# Altium project Lens-Maker.PrjPcb
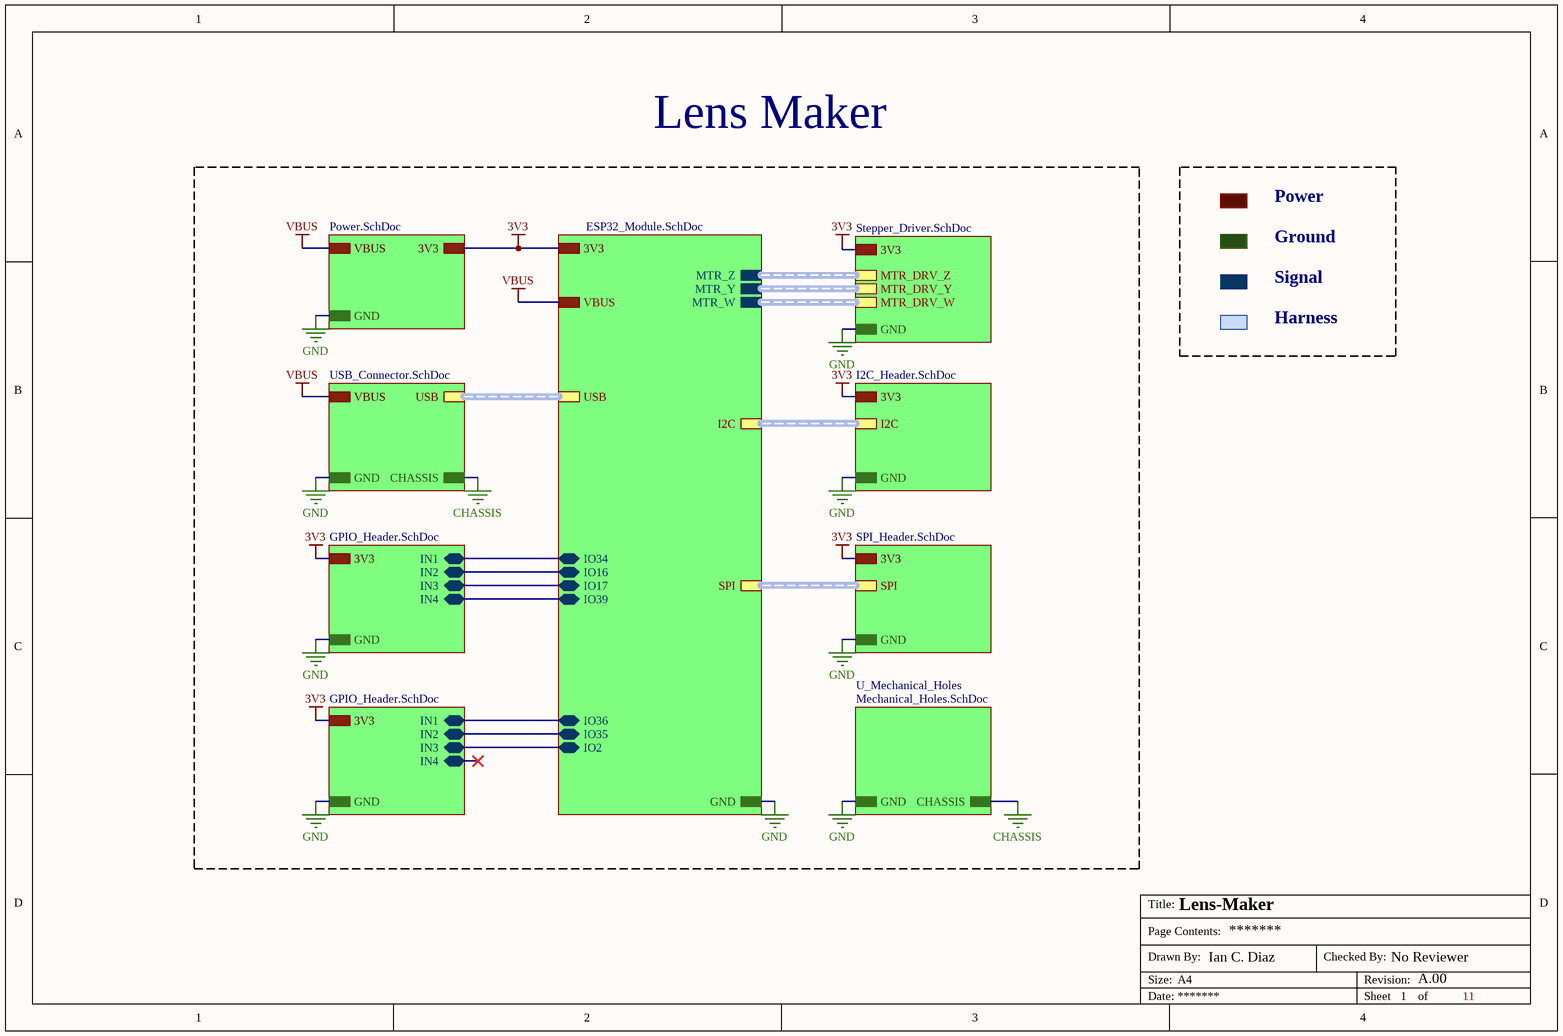
[diagram p0: Lens-Maker.SchDoc]
pcb_author: Ian C. Diaz; pcb_name: Lens-Maker; pcb_rev: A.00; pcb_reviewer: No Reviewer; TotalSheet: 11
11 sheets, 125 parts. Net scope: hierarchical (ports join the sheet entries above them; power ports are global).
Board file: Lens-Maker.PcbDoc
Sheets:
  Lens-Maker.SchDoc
    U_ESP32_Module = ESP32_Module.SchDoc
      U_ESP32_Block = ESP32_Block.SchDoc
    U_GPIO_Header = GPIO_Header.SchDoc
    U_I2C_Header = I2C_Header.SchDoc
    U_SPI_Header = SPI_Header.SchDoc
    U_Stepper_Driver = Stepper_Driver.SchDoc
      U_A4988 = A4988.SchDoc
      U_A4988 = A4988.SchDoc
      U_A4988 = A4988.SchDoc
    U_GPIO_Header = GPIO_Header.SchDoc
    U_USB_Connector = USB_Connector.SchDoc
    U_Power = Power.SchDoc
    U_Mechanical_Holes = Mechanical_Holes.SchDoc

## Sheet Lens-Maker.SchDoc: Title
size A4; Date: *******; ApprovedBy: *******; CheckedBy: None; Author: *******; CompanyName: *******; DrawnBy: Name; Engineer: *******; Organization: *******; Address1: *******; Address2: *******; Address3: *******; Address4: *******; DocumentNumber: 1; Revision: *******; SheetNumber: 1; SheetTotal: 11; CurrentTime: *******; CurrentDate: *******; Time: *******; DocumentFullPathAndName: *******; DocumentName: *******; ModifiedDate: *******; ImagePath: *******; ProjectName: *******; Application_BuildNumber: *******

### Sub-sheets
U_ESP32_Module = ESP32_Module.SchDoc: 3V3, GND, MTR_Z (harness MTR_DRV), MTR_W (harness MTR_DRV), MTR_Y (harness MTR_DRV), IO34 (bidir), IO16 (bidir), IO17 (bidir), I2C (harness I2C), SPI (harness SPI), IO39 (bidir), IO36 (bidir), IO35 (bidir), IO2 (bidir), VBUS, USB (harness USB)
U_GPIO_Header = GPIO_Header.SchDoc: 3V3, GND, IN1 (bidir), IN2 (bidir), IN3 (bidir), IN4 (bidir)
U_GPIO_Header = GPIO_Header.SchDoc: 3V3, GND, IN1 (bidir), IN2 (bidir), IN3 (bidir), IN4 (bidir)
U_I2C_Header = I2C_Header.SchDoc: 3V3, GND, I2C (harness I2C)
U_Mechanical_Holes = Mechanical_Holes.SchDoc: GND, CHASSIS
U_Power = Power.SchDoc: 3V3, GND, VBUS
U_SPI_Header = SPI_Header.SchDoc: 3V3, GND, SPI (harness SPI)
U_Stepper_Driver = Stepper_Driver.SchDoc: 3V3, GND, MTR_DRV_Z (harness MTR_DRV), MTR_DRV_Y (harness MTR_DRV), MTR_DRV_W (harness MTR_DRV)
U_USB_Connector = USB_Connector.SchDoc: GND, CHASSIS, VBUS, USB (harness USB)

### Nets
3V3: sheet U_ESP32_Module/3V3, sheet U_GPIO_Header/3V3, sheet U_I2C_Header/3V3, sheet U_SPI_Header/3V3, sheet U_Stepper_Driver/3V3, sheet U_GPIO_Header/3V3, sheet U_Power/3V3
CHASSIS: sheet U_USB_Connector/CHASSIS, sheet U_Mechanical_Holes/CHASSIS
GND: sheet U_ESP32_Module/GND, sheet U_GPIO_Header/GND, sheet U_I2C_Header/GND, sheet U_SPI_Header/GND, sheet U_Stepper_Driver/GND, sheet U_GPIO_Header/GND, sheet U_USB_Connector/GND, sheet U_Power/GND, sheet U_Mechanical_Holes/GND
VBUS: sheet U_ESP32_Module/VBUS, sheet U_USB_Connector/VBUS, sheet U_Power/VBUS
IN1: sheet U_ESP32_Module/IO34, sheet U_GPIO_Header/IN1
IN1: sheet U_ESP32_Module/IO36, sheet U_GPIO_Header/IN1  [a separate net that carries the same name]
IN2: sheet U_ESP32_Module/IO35, sheet U_GPIO_Header/IN2
IN2: sheet U_ESP32_Module/IO16, sheet U_GPIO_Header/IN2  [a separate net that carries the same name]
IN3: sheet U_ESP32_Module/IO2, sheet U_GPIO_Header/IN3
IN3: sheet U_ESP32_Module/IO17, sheet U_GPIO_Header/IN3  [a separate net that carries the same name]
IN4: sheet U_ESP32_Module/IO39, sheet U_GPIO_Header/IN4

### Buses and harness runs
harness sheet U_ESP32_Module/I2C = sheet U_I2C_Header/I2C
harness sheet U_ESP32_Module/MTR_W = sheet U_Stepper_Driver/MTR_DRV_W
harness sheet U_ESP32_Module/MTR_Y = sheet U_Stepper_Driver/MTR_DRV_Y
harness sheet U_ESP32_Module/MTR_Z = sheet U_Stepper_Driver/MTR_DRV_Z
harness sheet U_ESP32_Module/SPI = sheet U_SPI_Header/SPI
harness sheet U_ESP32_Module/USB = sheet U_USB_Connector/USB

### Notes on the sheet
- Lens Maker
- Power
- Ground
- Signal
- Harness
- Title:
- Size:
- Date:
- Drawn By:
- Page Contents:
- A4
- Checked By:
- Revision:
- Sheet
- of

## Sheet ESP32_Module.SchDoc: Title
size A4; Date: *******; ApprovedBy: *******; CheckedBy: None; Author: *******; CompanyName: *******; DrawnBy: Name; Engineer: *******; Organization: *******; Address1: *******; Address2: *******; Address3: *******; Address4: *******; DocumentNumber: 5; Revision: *******; SheetNumber: 5; SheetTotal: 11; CurrentTime: *******; CurrentDate: *******; Time: *******; DocumentFullPathAndName: *******; DocumentName: *******; ModifiedDate: *******; ImagePath: *******; ProjectName: *******; Application_BuildNumber: *******
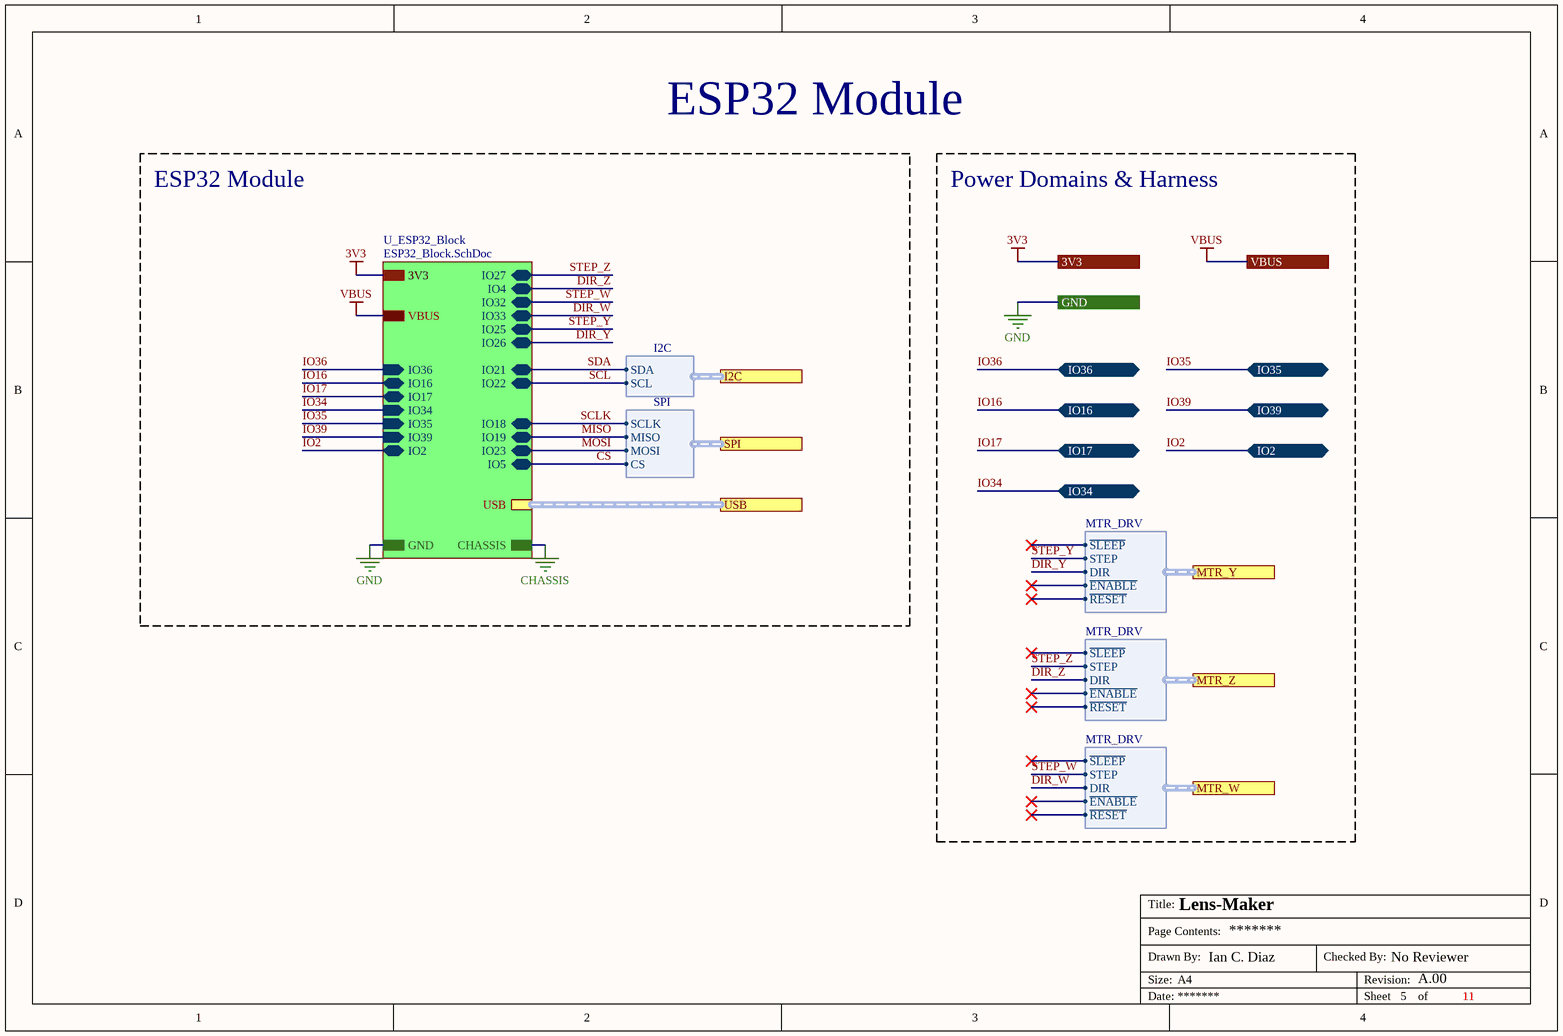
[diagram p1: ESP32_Module.SchDoc]

### Sub-sheets
U_ESP32_Block = ESP32_Block.SchDoc: IO34 (in), IO35 (in), IO32 (bidir), IO33 (bidir), IO25 (bidir), IO26 (bidir), IO27 (bidir), IO2 (bidir), IO4 (bidir), IO16 (bidir), IO17 (bidir), IO5 (bidir), IO18 (bidir), IO19 (bidir), IO21 (bidir), IO22 (bidir), IO23 (bidir), IO36 (in), IO39 (in), 3V3, GND, CHASSIS, VBUS, USB (harness USB)

### Ports
3V3 (see Lens-Maker[2A], A4988[3B], ESP32_Block[3C], GPIO_Header[3B], I2C_Header[3B], Power[3B], SPI_Header[3B], Stepper_Driver[3A]), GND (see Lens-Maker[2D], A4988[3B], ESP32_Block[3D], GPIO_Header[3B], I2C_Header[3B], Mechanical_Holes[3B], Power[3C], SPI_Header[3B], Stepper_Driver[3B], USB_Connector[3B]), I2C (harness I2C, see Lens-Maker[2B], I2C_Header[3C]), IO2 (bidir, see Lens-Maker[2C], ESP32_Block[4C]), IO16 (bidir, see Lens-Maker[2C], ESP32_Block[4C]), IO17 (bidir, see Lens-Maker[2C], ESP32_Block[4C]), IO34 (bidir, see Lens-Maker[2C], ESP32_Block[3C]), IO35 (bidir, see Lens-Maker[2C], ESP32_Block[3C]), IO36 (bidir, see Lens-Maker[2C], ESP32_Block[4C]), IO39 (bidir, see Lens-Maker[2C], ESP32_Block[4D]), MTR_W (harness MTR_DRV, see Lens-Maker[2B]), MTR_Y (harness MTR_DRV, see Lens-Maker[2B]), MTR_Z (harness MTR_DRV, see Lens-Maker[2B]), SPI (harness SPI, see Lens-Maker[2C], SPI_Header[3C]), USB (harness USB, see Lens-Maker[2B], ESP32_Block[3C], USB_Connector[3C]), VBUS (see Lens-Maker[2B], ESP32_Block[3C], Power[3B], USB_Connector[3B])

### Harnesses
I2C: SDA, SCL
SPI: SCLK, MISO, MOSI, CS
MTR_DRV: ~{SLEEP}, STEP, DIR, ~{ENABLE}, ~{RESET}

### Nets
3V3: port 3V3, sheet U_ESP32_Block/3V3
GND: port GND, sheet U_ESP32_Block/GND
VBUS: port VBUS, sheet U_ESP32_Block/VBUS
CS: sheet U_ESP32_Block/IO5, port SPI.CS
DIR_W: sheet U_ESP32_Block/IO33, port MTR_W.DIR  [project net DIR]
DIR_Y: sheet U_ESP32_Block/IO26, port MTR_Y.DIR  [project net DIR]
DIR_Z: sheet U_ESP32_Block/IO4, port MTR_Z.DIR  [project net DIR]
IO2: port IO2, sheet U_ESP32_Block/IO2  [project net IN3]
IO16: port IO16, sheet U_ESP32_Block/IO16  [project net IN2]
IO17: port IO17, sheet U_ESP32_Block/IO17  [project net IN3]
IO34: port IO34, sheet U_ESP32_Block/IO34  [project net IN1]
IO35: port IO35, sheet U_ESP32_Block/IO35  [project net IN2]
IO36: port IO36, sheet U_ESP32_Block/IO36  [project net IN1]
IO39: port IO39, sheet U_ESP32_Block/IO39  [project net IN4]
MISO: sheet U_ESP32_Block/IO19, port SPI.MISO  [project net IO19]
MOSI: sheet U_ESP32_Block/IO23, port SPI.MOSI  [project net IO23]
~{RST}_U_A4988: port MTR_Z.~{SLEEP}, port MTR_Z.~{RESET}
~{RST}_U_A4988: port MTR_Y.~{SLEEP}, port MTR_Y.~{RESET}  [a separate net that carries the same name]
~{RST}_U_A4988: port MTR_W.~{SLEEP}, port MTR_W.~{RESET}  [a separate net that carries the same name]
SCL: sheet U_ESP32_Block/IO22, port I2C.SCL  [project net IO22]
SCLK: sheet U_ESP32_Block/IO18, port SPI.SCLK  [project net IO18]
SDA: sheet U_ESP32_Block/IO21, port I2C.SDA  [project net IO21]
STEP_W: sheet U_ESP32_Block/IO32, port MTR_W.STEP  [project net IO32]
STEP_Y: sheet U_ESP32_Block/IO25, port MTR_Y.STEP  [project net IO25]
STEP_Z: sheet U_ESP32_Block/IO27, port MTR_Z.STEP  [project net IO27]

### Buses and harness runs
harness port USB = sheet U_ESP32_Block/USB

### Notes on the sheet
- ESP32 Module
- Power Domains & Harness
- Title:
- Size:
- Date:
- Drawn By:
- Page Contents:
- A4
- Checked By:
- Revision:
- Sheet
- of

## Sheet ESP32_Block.SchDoc: Title
size A4; Date: *******; ApprovedBy: *******; CheckedBy: None; Author: *******; CompanyName: *******; DrawnBy: Name; Engineer: *******; Organization: *******; Address1: *******; Address2: *******; Address3: *******; Address4: *******; DocumentNumber: 6; Revision: *******; SheetNumber: 6; SheetTotal: 11; CurrentTime: *******; CurrentDate: *******; Time: *******; DocumentFullPathAndName: *******; DocumentName: *******; ModifiedDate: *******; ImagePath: *******; ProjectName: *******; Application_BuildNumber: *******
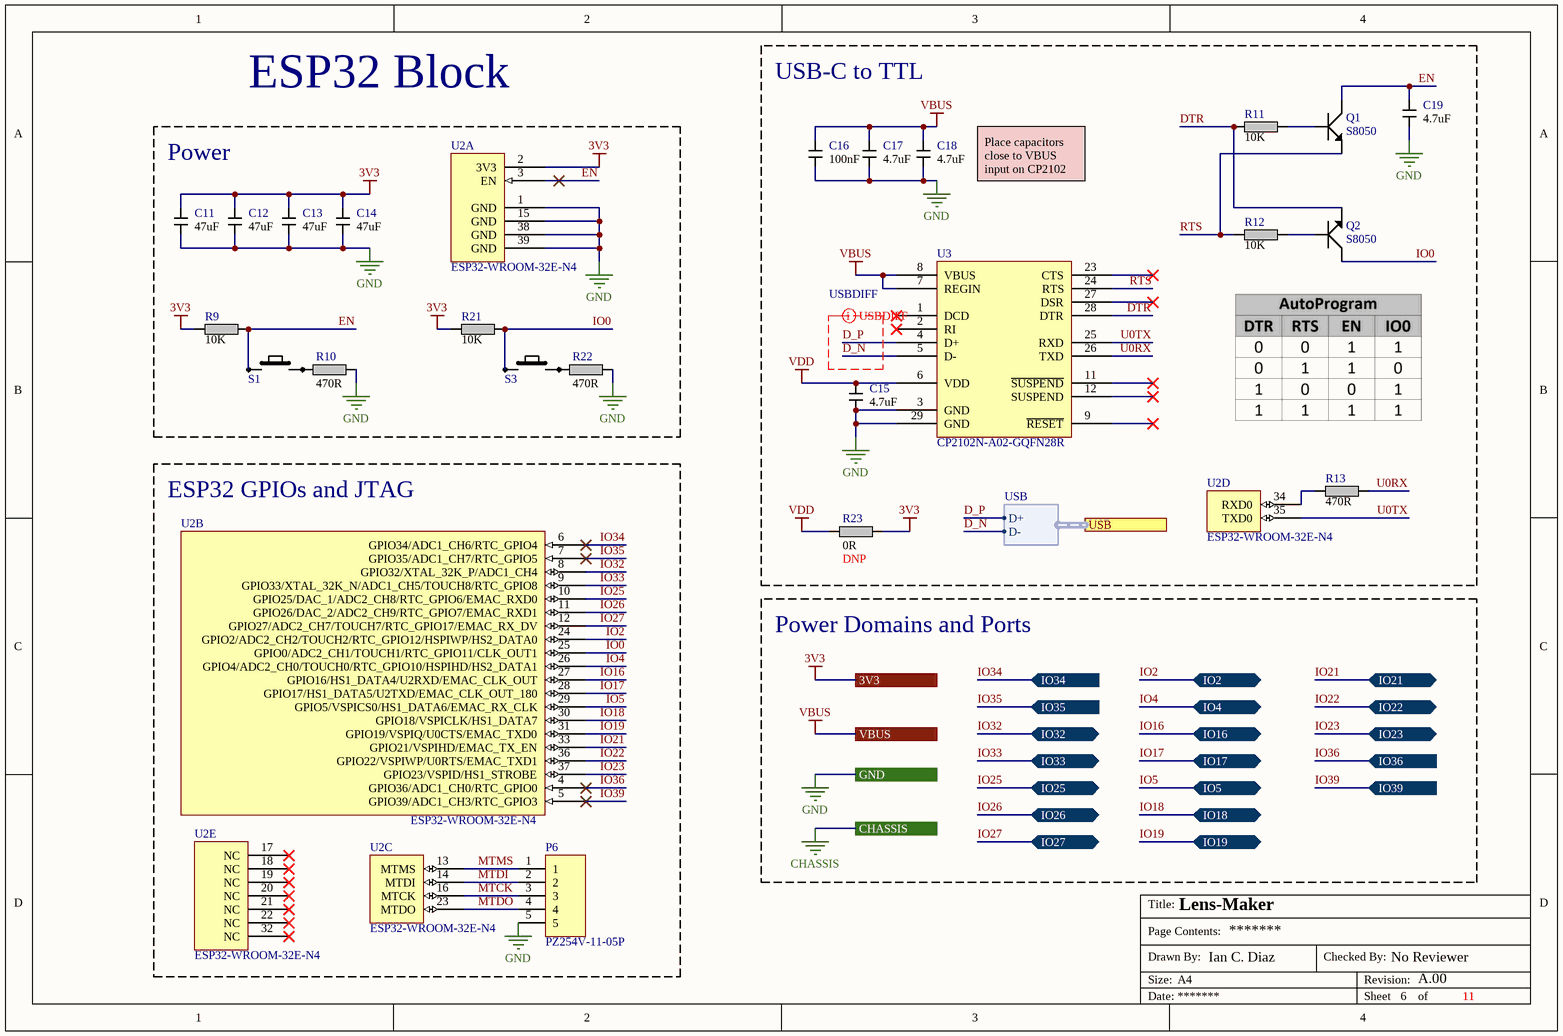
[diagram p2: ESP32_Block.SchDoc]

### Parts
C11  value 47uF  [1206]  (hidden comment: CAP)
C12  value 47uF  [1206]  (hidden comment: CAP)
C13  value 47uF  [1206]  (hidden comment: CAP)
C14  value 47uF  [1206]  (hidden comment: CAP)
C15  value 4.7uF  [0805]  (hidden comment: CAP)
C16  value 100nF  [0805]  (hidden comment: CAP)
C17  value 4.7uF  [0805]  (hidden comment: CAP)
C18  value 4.7uF  [0805]  (hidden comment: CAP)
C19  value 4.7uF  [0805]  (hidden comment: CAP)
P6  HEADER-5P-SR  [PZ254V-11-05P]  (value not drawn)
Q1  S8050  [SOT-23-3]
Q2  S8050  [SOT-23-3]
R9  value 10K  [0805]  (hidden comment: RES)
R10  value 470R  [0805]  (hidden comment: RES)
R11  value 10K  [0805]  (hidden comment: RES)
R12  value 10K  [0805]  (hidden comment: RES)
R13  value 470R  [0805]  (hidden comment: RES)
R21  value 10K  [0805]  (hidden comment: RES)
R22  value 470R  [0805]  (hidden comment: RES)
R23  value 0R  DM: DNP  [0805]  (hidden comment: RES)
S1  RST  [PUSHBUTTON_2]  (value not drawn)
S3  BOOT  [PUSHBUTTON_2]  (value not drawn)
U2  Manufacturer Part Number: ESP32-WROOM-32E-N4  [ESP32-WROOM-32E]  (hidden comment: ESP32-WROOM-32E)  (parts A,B,C,D,E of 5)
U3  Manufacturer Part Number: CP2102N-A02-GQFN28R  [CP2102N]  (hidden comment: CP2102)

### Blocks framed on the sheet
USB-C to TTL: C15-C19 Q1 Q2 R11-R13 R23 U2 U3
Power: C11-C14 R9 R10 R21 R22 S1 S3 U2
ESP32 GPIOs and JTAG: P6 U2

### Ports
3V3 (see ESP32_Module[1B], A4988[3B], ESP32_Module[3B], GPIO_Header[3B], I2C_Header[3B], Power[3B], SPI_Header[3B], Stepper_Driver[3A]), CHASSIS (see ESP32_Module[2C], Mechanical_Holes[3C], USB_Connector[3C]), GND (see ESP32_Module[1C], A4988[3B], ESP32_Module[3B], GPIO_Header[3B], I2C_Header[3B], Mechanical_Holes[3B], Power[3C], SPI_Header[3B], Stepper_Driver[3B], USB_Connector[3B]), IO2 (bidir, see ESP32_Module[1B], ESP32_Module[4B]), IO4 (bidir, see ESP32_Module[2B]), IO5 (bidir, see ESP32_Module[2B]), IO16 (bidir, see ESP32_Module[1B], ESP32_Module[3B]), IO17 (bidir, see ESP32_Module[1B], ESP32_Module[3B]), IO18 (bidir, see ESP32_Module[2B]), IO19 (bidir, see ESP32_Module[2B]), IO21 (bidir, see ESP32_Module[2B]), IO22 (bidir, see ESP32_Module[2B]), IO23 (bidir, see ESP32_Module[2B]), IO25 (bidir, see ESP32_Module[2B]), IO26 (bidir, see ESP32_Module[2B]), IO27 (bidir, see ESP32_Module[2B]), IO32 (bidir, see ESP32_Module[2B]), IO33 (bidir, see ESP32_Module[2B]), IO34 (in, see ESP32_Module[1B], ESP32_Module[3B]), IO35 (in, see ESP32_Module[1B], ESP32_Module[4B]), IO36 (in, see ESP32_Module[1B], ESP32_Module[3B]), IO39 (in, see ESP32_Module[1B], ESP32_Module[4B]), USB (harness USB, see ESP32_Module[2B], USB_Connector[3C]), VBUS (see ESP32_Module[1B], ESP32_Module[4B], Power[3B], USB_Connector[3B])

### Harnesses
USB: D+, D-

### Nets
3V3: C11.1 C12.1 C13.1 C14.1 R9.2 R21.2 R23.1 U2.2(3V3) ; port 3V3
GND: C11.2 C12.2 C13.2 C14.2 C15.2 C16.1 C17.2 C18.2 C19.2 P6.5 R10.1 R22.1 U2.1(GND) U2.15(GND) U2.38(GND) U2.39(GND) U3.3(GND) U3.29(GND) ; port GND
VBUS: C16.2 C17.1 C18.1 U3.7(REGIN) U3.8(VBUS) ; port VBUS
VDD: C15.1 R23.2 U3.6(VDD)
D_N: U3.5(D-) ; port USB.D-
D_P: U3.4(D+) ; port USB.D+
DTR: Q2.2 R11.2 U3.28(DTR)
EN: C19.1 Q1.3 R9.1 S1.1 U2.3(EN)
IO0: Q2.3 R21.1 S3.1 U2.25(GPIO0/ADC2_CH1/TOUCH1/RTC_GPIO11/CLK_OUT1)
IO2: U2.24(GPIO2/ADC2_CH2/TOUCH2/RTC_GPIO12/HSPIWP/HS2_DATA0) ; port IO2  [project net IN3]
IO4: U2.26(GPIO4/ADC2_CH0/TOUCH0/RTC_GPIO10/HSPIHD/HS2_DATA1) ; port IO4  [project net DIR]
IO5: U2.29(GPIO5/VSPICS0/HS1_DATA6/EMAC_RX_CLK) ; port IO5  [project net CS]
IO16: U2.27(GPIO16/HS1_DATA4/U2RXD/EMAC_CLK_OUT) ; port IO16  [project net IN2]
IO17: U2.28(GPIO17/HS1_DATA5/U2TXD/EMAC_CLK_OUT_180) ; port IO17  [project net IN3]
IO18: U2.30(GPIO18/VSPICLK/HS1_DATA7) ; port IO18
IO19: U2.31(GPIO19/VSPIQ/U0CTS/EMAC_TXD0) ; port IO19
IO21: U2.33(GPIO21/VSPIHD/EMAC_TX_EN) ; port IO21
IO22: U2.36(GPIO22/VSPIWP/U0RTS/EMAC_TXD1) ; port IO22
IO23: U2.37(GPIO23/VSPID/HS1_STROBE) ; port IO23
IO25: U2.10(GPIO25/DAC_1/ADC2_CH8/RTC_GPIO6/EMAC_RXD0) ; port IO25
IO26: U2.11(GPIO26/DAC_2/ADC2_CH9/RTC_GPIO7/EMAC_RXD1) ; port IO26  [project net DIR]
IO27: U2.12(GPIO27/ADC2_CH7/TOUCH7/RTC_GPIO17/EMAC_RX_DV) ; port IO27
IO32: U2.8(GPIO32/XTAL_32K_P/ADC1_CH4) ; port IO32
IO33: U2.9(GPIO33/XTAL_32K_N/ADC1_CH5/TOUCH8/RTC_GPIO8) ; port IO33  [project net DIR]
IO34: U2.6(GPIO34/ADC1_CH6/RTC_GPIO4) ; port IO34  [project net IN1]
IO35: U2.7(GPIO35/ADC1_CH7/RTC_GPIO5) ; port IO35  [project net IN2]
IO36: U2.4(GPIO36/ADC1_CH0/RTC_GPIO0) ; port IO36  [project net IN1]
IO39: U2.5(GPIO39/ADC1_CH3/RTC_GPIO3) ; port IO39  [project net IN4]
MTCK: P6.3 U2.16(MTCK)
MTDI: P6.2 U2.14(MTDI)
MTDO: P6.4 U2.23(MTDO)
MTMS: P6.1 U2.13(MTMS)
RTS: Q1.2 R12.2 U3.24(RTS)
U0RX: R13.2 U3.26(TXD)
U0TX: U2.35(TXD0) U3.25(RXD)
NetQ1_1: Q1.1 R11.1
NetQ2_1: Q2.1 R12.1
NetR10_2: R10.2 S1.2
NetR13_1: R13.1 U2.34(RXD0)
NetR22_2: R22.2 S3.2

Not connected (* = marked no-connect by the designer): U2 17(NC)* 18(NC)* 19(NC)* 20(NC)* 21(NC)* 22(NC)* 32(NC)*; U3 1(DCD)* 2(RI)* 9(~{RESET})* 11(~{SUSPEND})* 12(SUSPEND)* 23(CTS)* 27(DSR)*

### Layout directives
differential pair; differential pair class USBDIFF: D_N, D_P

### Notes on the sheet
- ESP32 Block
- Place capacitors close to VBUS input on CP2102
- Power Domains and Ports
- Title:
- Size:
- Date:
- Drawn By:
- Page Contents:
- A4
- Checked By:
- Revision:
- Sheet
- of

### Library data of the parts
C11-C14 = CAP: 25V 47uF X5R ±20% 1206  Multilayer Ceramic Capacitors MLCC - SMD/SMT ROHS; Manufacturer: TDK; Manufacturer Part Number: C3216X5R1E476MTJ00E; Supplier: JLCPCB; Supplier Part Number: C76659
C15 C17-C19 = CAP: 35V 4.7uF X7R ±10% 0805  Multilayer Ceramic Capacitors MLCC - SMD/SMT ROHS; Manufacturer: Samwha Capacitor; Manufacturer Part Number: CS2012X7R475K350NRE; Supplier: JLCPCB; Supplier Part Number: C560882
C16 = CAP: 50V 100nF X7R ±10% 0805  Multilayer Ceramic Capacitors MLCC - SMD/SMT ROHS; Manufacturer: YAGEO; Manufacturer Part Number: CC0805KRX7R9BB104; Supplier: JLCPCB; Supplier Part Number: C49678
P6 = HEADER-5P-SR: Straight Square Pins 2.5mm 6mm -40℃~+105℃ 3mm 5 2.54mm Black Brass 1x5P Plugin,P=2.54mm  Pin Headers ROHS; Manufacturer: XFCN; Supplier: JLCPCB; Supplier Part Number: C492404; Manufacturer Part Number: PZ254V-11-05P
Q1 Q2 = S8050: 25V 300mW 500mA SOT-23  Bipolar Transistors - BJT ROHS; Manufacturer: JSMSEMI; Supplier: JLCPCB; Supplier Part Number: C916390; Manufacturer Part Number: S8050
R9 R11 R12 R21 = RES: 125mW Thick Film Resistors ±1% 10kΩ 0805  Chip Resistor - Surface Mount ROHS; Manufacturer: UNI-ROYAL(Uniroyal Elec); Manufacturer Part Number: 0805W8F1002T5E; Supplier: JLCPCB; Supplier Part Number: C17414
R10 R13 R22 = RES: 125mW Thick Film Resistors ±1% 470Ω 0805  Chip Resistor - Surface Mount ROHS; Manufacturer: UNI-ROYAL(Uniroyal Elec); Manufacturer Part Number: 0805W8F4700T5E; Supplier: JLCPCB; Supplier Part Number: C17710
R23 = RES: 125mW 0Ω 0805 Chip Resistor - Surface Mount ROHS; Manufacturer: PANASONIC; Manufacturer Part Number: ERJ6GEY0R00V; Supplier: JLCPCB; Supplier Part Number: C169855
S1 S3 = PUSHBUTTON_2: SWITCH TACTILE SPST-NO 0.05A 12V; Manufacturer: C&K; Manufacturer Part Number: PTS645SM43SMTR92LFS; Supplier: JLCPCB; Supplier Part Number: C221880
U2 = ESP32-WROOM-32E: RX TXRX MOD WIFI TRACE ANT SMD; Manufacturer: Espressif Systems; Supplier: JLCPCB; Supplier Part Number: C701341
U3 = CP2102: QFN-28 USB ICs ROHS; Manufacturer: SILICON LABS; Supplier: JLCPCB; Supplier Part Number: C964632

## Sheet GPIO_Header.SchDoc: Title
size A4; Date: *******; ApprovedBy: *******; CheckedBy: None; Author: *******; CompanyName: *******; DrawnBy: Name; Engineer: *******; Organization: *******; Address1: *******; Address2: *******; Address3: *******; Address4: *******; DocumentNumber: 9; Revision: *******; SheetNumber: 9; SheetTotal: 11; CurrentTime: *******; CurrentDate: *******; Time: *******; DocumentFullPathAndName: *******; DocumentName: *******; ModifiedDate: *******; ImagePath: *******; ProjectName: *******; Application_BuildNumber: *******
Used 2 times, as channels U_GPIO_Header, U_GPIO_Header. Parts and nets are listed once, with the designators drawn on the sheet.
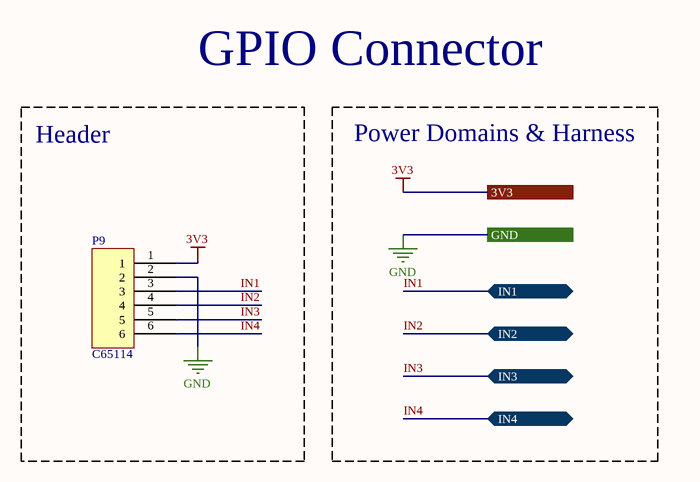
[diagram p3: GPIO_Header.SchDoc]

### Parts
P9  Manufacturer Part Number: C65114  [HEADER 3X2]  (hidden comment: HEADER 6POS)

### Blocks framed on the sheet
Header: P9

### Ports
3V3 (see Lens-Maker[1C], A4988[3B], ESP32_Block[3C], ESP32_Module[3B], I2C_Header[3B], Power[3B], SPI_Header[3B], Stepper_Driver[3A]), GND (see Lens-Maker[1D], A4988[3B], ESP32_Block[3D], ESP32_Module[3B], I2C_Header[3B], Mechanical_Holes[3B], Power[3C], SPI_Header[3B], Stepper_Driver[3B], USB_Connector[3B]), IN1 (bidir, see Lens-Maker[2C]), IN2 (bidir, see Lens-Maker[2C]), IN3 (bidir, see Lens-Maker[2C]), IN4 (bidir, see Lens-Maker[2C])

### Nets
3V3: P9.1 ; port 3V3
GND: P9.2 ; port GND
IN1: P9.3 ; port IN1
IN2: P9.4 ; port IN2
IN3: P9.5 ; port IN3
IN4: P9.6 ; port IN4

### Channels
U_GPIO_Header: designators end in _2; ports 3V3=3V3 GND=GND IN1=IN1 IN2=IN2 IN3=IN3 IN4=IN4
U_GPIO_Header: designators end in _1; ports 3V3=3V3 GND=GND IN1=IN1 IN2=IN2 IN3=IN3 IN4=IN4_U_GPIO_Header

### Notes on the sheet
- GPIO Connector
- Power Domains & Harness
- Title:
- Size:
- Date:
- Drawn By:
- Page Contents:
- A4
- Checked By:
- Revision:
- Sheet
- of

### Library data of the parts
P9 = HEADER 6POS: Straight 2 6 2.54mm Black Straight,P=2.54mm  Pin Headers ROHS; Manufacturer: BOOMELE(Boom Precision Elec); Supplier: JLCPCB; Supplier Part Number: C65114

## Sheet I2C_Header.SchDoc: Title
size A4; Date: *******; ApprovedBy: *******; CheckedBy: None; Author: *******; CompanyName: *******; DrawnBy: Name; Engineer: *******; Organization: *******; Address1: *******; Address2: *******; Address3: *******; Address4: *******; DocumentNumber: 8; Revision: *******; SheetNumber: 8; SheetTotal: 11; CurrentTime: *******; CurrentDate: *******; Time: *******; DocumentFullPathAndName: *******; DocumentName: *******; ModifiedDate: *******; ImagePath: *******; ProjectName: *******; Application_BuildNumber: *******
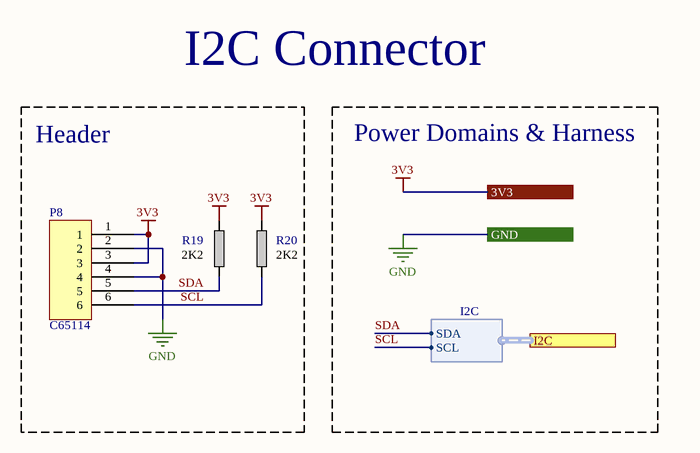
[diagram p4: I2C_Header.SchDoc]

### Parts
P8  Manufacturer Part Number: C65114  [HEADER 3X2]  (hidden comment: HEADER 6POS)
R19  value 2K2  [0805]  (hidden comment: RES)
R20  value 2K2  [0805]  (hidden comment: RES)

### Blocks framed on the sheet
Header: P8 R19 R20

### Ports
3V3 (see Lens-Maker[3B], A4988[3B], ESP32_Block[3C], ESP32_Module[3B], GPIO_Header[3B], Power[3B], SPI_Header[3B], Stepper_Driver[3A]), GND (see Lens-Maker[3B], A4988[3B], ESP32_Block[3D], ESP32_Module[3B], GPIO_Header[3B], Mechanical_Holes[3B], Power[3C], SPI_Header[3B], Stepper_Driver[3B], USB_Connector[3B]), I2C (harness I2C, see Lens-Maker[3B], ESP32_Module[2B])

### Harnesses
I2C: SDA, SCL

### Nets
3V3: P8.1 P8.3 R19.1 R20.1 ; port 3V3
GND: P8.2 P8.4 ; port GND
SCL: P8.6 R20.2 ; port I2C.SCL  [project net IO22]
SDA: P8.5 R19.2 ; port I2C.SDA  [project net IO21]

### Notes on the sheet
- I2C Connector
- Power Domains & Harness
- Title:
- Size:
- Date:
- Drawn By:
- Page Contents:
- A4
- Checked By:
- Revision:
- Sheet
- of

### Library data of the parts
P8 = HEADER 6POS: as P9 on sheet GPIO_Header; Supplier: JLCPCB; Supplier Part Number: C65114
R19 R20 = RES: 125mW Thick Film Resistors ±5% 2.2kΩ 0805  Chip Resistor - Surface Mount ROHS; Manufacturer: LIZ Elec; Manufacturer Part Number: CR0805J80222G; Supplier: JLCPCB; Supplier Part Number: C101970

## Sheet SPI_Header.SchDoc: Title
size A4; Date: *******; ApprovedBy: *******; CheckedBy: None; Author: *******; CompanyName: *******; DrawnBy: Name; Engineer: *******; Organization: *******; Address1: *******; Address2: *******; Address3: *******; Address4: *******; DocumentNumber: 7; Revision: *******; SheetNumber: 7; SheetTotal: 11; CurrentTime: *******; CurrentDate: *******; Time: *******; DocumentFullPathAndName: *******; DocumentName: *******; ModifiedDate: *******; ImagePath: *******; ProjectName: *******; Application_BuildNumber: *******
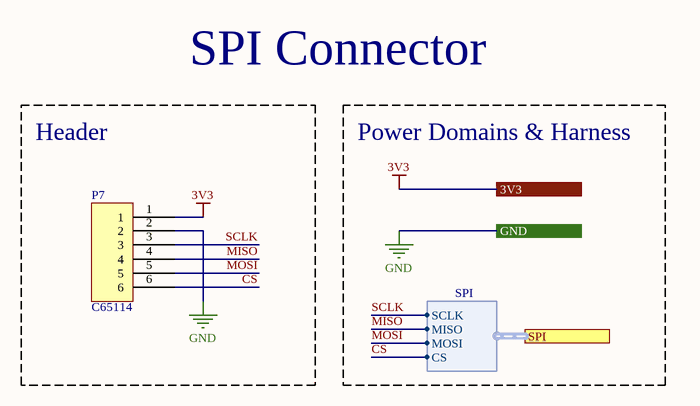
[diagram p5: SPI_Header.SchDoc]

### Parts
P7  Manufacturer Part Number: C65114  [HEADER 3X2]  (hidden comment: HEADER 6POS)

### Blocks framed on the sheet
Header: P7

### Ports
3V3 (see Lens-Maker[3C], A4988[3B], ESP32_Block[3C], ESP32_Module[3B], GPIO_Header[3B], I2C_Header[3B], Power[3B], Stepper_Driver[3A]), GND (see Lens-Maker[3C], A4988[3B], ESP32_Block[3D], ESP32_Module[3B], GPIO_Header[3B], I2C_Header[3B], Mechanical_Holes[3B], Power[3C], Stepper_Driver[3B], USB_Connector[3B]), SPI (harness SPI, see Lens-Maker[3C], ESP32_Module[2B])

### Harnesses
SPI: SCLK, MISO, MOSI, CS

### Nets
3V3: P7.1 ; port 3V3
GND: P7.2 ; port GND
CS: P7.6 ; port SPI.CS
MISO: P7.4 ; port SPI.MISO  [project net IO19]
MOSI: P7.5 ; port SPI.MOSI  [project net IO23]
SCLK: P7.3 ; port SPI.SCLK  [project net IO18]

### Notes on the sheet
- SPI Connector
- Power Domains & Harness
- Title:
- Size:
- Date:
- Drawn By:
- Page Contents:
- A4
- Checked By:
- Revision:
- Sheet
- of

### Library data of the parts
P7 = HEADER 6POS: as P9 on sheet GPIO_Header; Supplier: JLCPCB; Supplier Part Number: C65114

## Sheet Stepper_Driver.SchDoc: Title
size A4; Date: *******; ApprovedBy: *******; CheckedBy: None; Author: *******; CompanyName: *******; DrawnBy: Name; Engineer: *******; Organization: *******; Address1: *******; Address2: *******; Address3: *******; Address4: *******; DocumentNumber: 3; Revision: *******; SheetNumber: 3; SheetTotal: 11; CurrentTime: *******; CurrentDate: *******; Time: *******; DocumentFullPathAndName: *******; DocumentName: *******; ModifiedDate: *******; ImagePath: *******; ProjectName: *******; Application_BuildNumber: *******
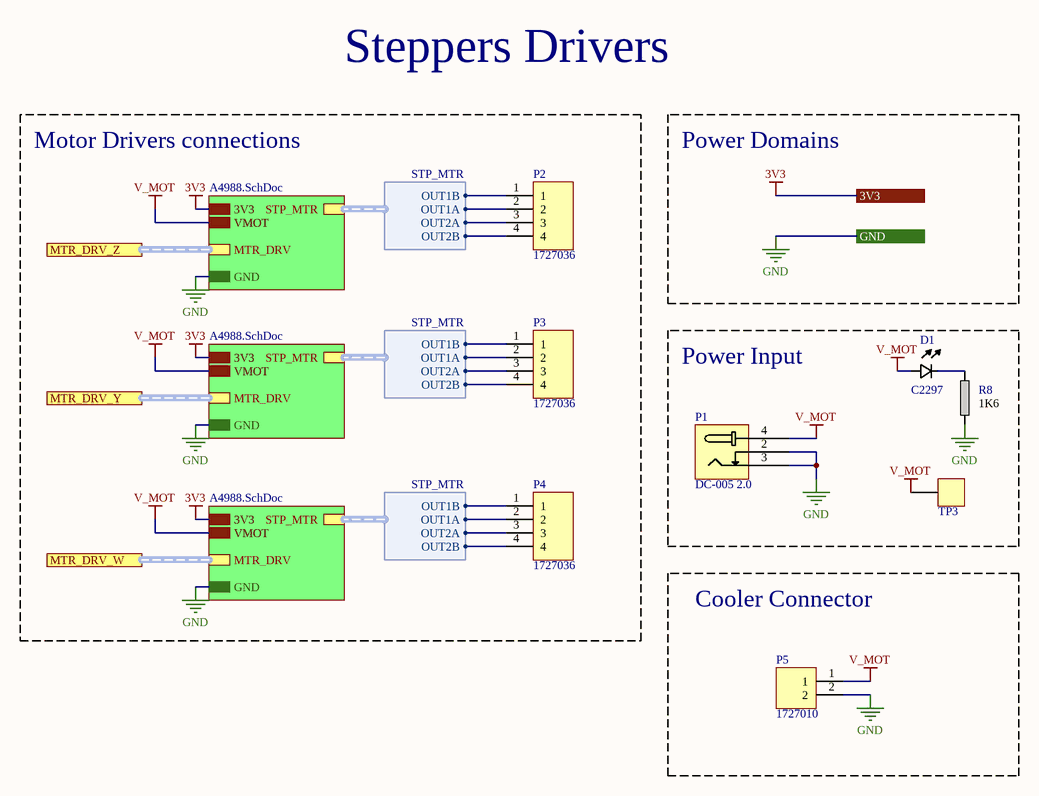
[diagram p6: Stepper_Driver.SchDoc]

### Parts
D1  Manufacturer Part Number: C2297  [0805]  (hidden comment: LED)
P1  DC-005 2.0  [DC-005 2.0]
P2  MOTOR Z  [1727036]  (value not drawn)
P3  MOTOR Y  [1727036]  (value not drawn)
P4  MOTOR W  [1727036]  (value not drawn)
P5  BORNERA SR-2  [1727010]  (value not drawn)
R8  value 1K6  [0805]  (hidden comment: RES)
TP3  12V  [5015]  (value not drawn)

### Blocks framed on the sheet
Motor Drivers connections: P2-P4
Power Input: D1 P1 R8 TP3
Cooler Connector: P5

### Sub-sheets
U_A4988 = A4988.SchDoc: MTR_DRV (harness MTR_DRV), STP_MTR (harness STP_MTR), 3V3, GND, VMOT
U_A4988 = A4988.SchDoc: MTR_DRV (harness MTR_DRV), STP_MTR (harness STP_MTR), 3V3, GND, VMOT
U_A4988 = A4988.SchDoc: MTR_DRV (harness MTR_DRV), STP_MTR (harness STP_MTR), 3V3, GND, VMOT

### Ports
3V3 (see Lens-Maker[3A], A4988[3B], ESP32_Block[3C], ESP32_Module[3B], GPIO_Header[3B], I2C_Header[3B], Power[3B], SPI_Header[3B]), GND (see Lens-Maker[3B], A4988[3B], ESP32_Block[3D], ESP32_Module[3B], GPIO_Header[3B], I2C_Header[3B], Mechanical_Holes[3B], Power[3C], SPI_Header[3B], USB_Connector[3B]), MTR_DRV_W (harness MTR_DRV, see Lens-Maker[3B]), MTR_DRV_Y (harness MTR_DRV, see Lens-Maker[3B]), MTR_DRV_Z (harness MTR_DRV, see Lens-Maker[3B])

### Harnesses
STP_MTR: OUT1A, OUT1B, OUT2A, OUT2B

### Nets
3V3: port 3V3, sheet U_A4988/3V3, sheet U_A4988/3V3, sheet U_A4988/3V3
GND: P1.2 P1.3 P5.2 R8.1 ; port GND, sheet U_A4988/GND, sheet U_A4988/GND, sheet U_A4988/GND
V_MOT: D1.1 P1.4 P5.1 TP3.1 ; sheet U_A4988/VMOT, sheet U_A4988/VMOT, sheet U_A4988/VMOT
1A: P2.2 ; sheet U_A4988/STP_MTR.OUT1A
1A: P3.2 ; sheet U_A4988/STP_MTR.OUT1A  [a separate net that carries the same name]
1A: P4.2 ; sheet U_A4988/STP_MTR.OUT1A  [a separate net that carries the same name]
1B: P2.1 ; sheet U_A4988/STP_MTR.OUT1B
1B: P3.1 ; sheet U_A4988/STP_MTR.OUT1B  [a separate net that carries the same name]
1B: P4.1 ; sheet U_A4988/STP_MTR.OUT1B  [a separate net that carries the same name]
2A: P2.3 ; sheet U_A4988/STP_MTR.OUT2A
2A: P3.3 ; sheet U_A4988/STP_MTR.OUT2A  [a separate net that carries the same name]
2A: P4.3 ; sheet U_A4988/STP_MTR.OUT2A  [a separate net that carries the same name]
2B: P2.4 ; sheet U_A4988/STP_MTR.OUT2B
2B: P3.4 ; sheet U_A4988/STP_MTR.OUT2B  [a separate net that carries the same name]
2B: P4.4 ; sheet U_A4988/STP_MTR.OUT2B  [a separate net that carries the same name]
NetD1_2: D1.2 R8.2

### Buses and harness runs
harness port MTR_DRV_W = sheet U_A4988/MTR_DRV
harness port MTR_DRV_Y = sheet U_A4988/MTR_DRV
harness port MTR_DRV_Z = sheet U_A4988/MTR_DRV

### Notes on the sheet
- Steppers Drivers
- Power Domains
- Title:
- Size:
- Date:
- Drawn By:
- Page Contents:
- A4
- Checked By:
- Revision:
- Sheet
- of

### Library data of the parts
D1 = LED: 0805 Light Emitting Diodes (LED) ROHS; Manufacturer: Hubei KENTO Elec; Supplier: JLCPCB; Supplier Part Number: C2297
P1 = DC-005 2.0: Shrouded DC Power Receptacle 2mm 6.4mm Plugin AC/DC Power Connectors ROHS; Manufacturer: BOOMELE(Boom Precision Elec); Supplier: JLCPCB; Supplier Part Number: C16214; Manufacturer Part Number: DC-005 2.0
P2-P4 = BORNERA SR-4: TERM BLK 4P SIDE ENT 3.81MM PCB; Manufacturer: Phoenix Contact; Supplier: JLCPCB; Supplier Part Number: C457200; Manufacturer Part Number: 1727036
P5 = BORNERA SR-2: TERM BLK 2P SIDE ENT 3.81MM PCB; Manufacturer: Phoenix Contact; Supplier: JLCPCB; Supplier Part Number: C89123; Manufacturer Part Number: 1727010
R8 = RES: 125mW Thick Film Resistors ±1% 1.6kΩ 0805  Chip Resistor - Surface Mount ROHS; Manufacturer: Resistor.Today; Manufacturer Part Number: AECR0805F1K60K9; Supplier: JLCPCB; Supplier Part Number: C352253
TP3 = TESTPOINT_5015: Thimble/Copper Rod/Test Ring ROHS; Manufacturer: Ronghe; Manufacturer Part Number: RH-5015; Supplier: JLCPCB; Supplier Part Number: C5199798

## Sheet A4988.SchDoc: Title
size A4; Date: *******; ApprovedBy: *******; CheckedBy: None; Author: *******; CompanyName: *******; DrawnBy: Name; Engineer: *******; Organization: *******; Address1: *******; Address2: *******; Address3: *******; Address4: *******; DocumentNumber: 4; Revision: *******; SheetNumber: 4; SheetTotal: 11; CurrentTime: *******; CurrentDate: *******; Time: *******; DocumentFullPathAndName: *******; DocumentName: *******; ModifiedDate: *******; ImagePath: *******; ProjectName: *******; Application_BuildNumber: *******
Used 3 times, as channels U_Stepper_Driver/U_A4988, U_Stepper_Driver/U_A4988, U_Stepper_Driver/U_A4988. Parts and nets are listed once, with the designators drawn on the sheet.
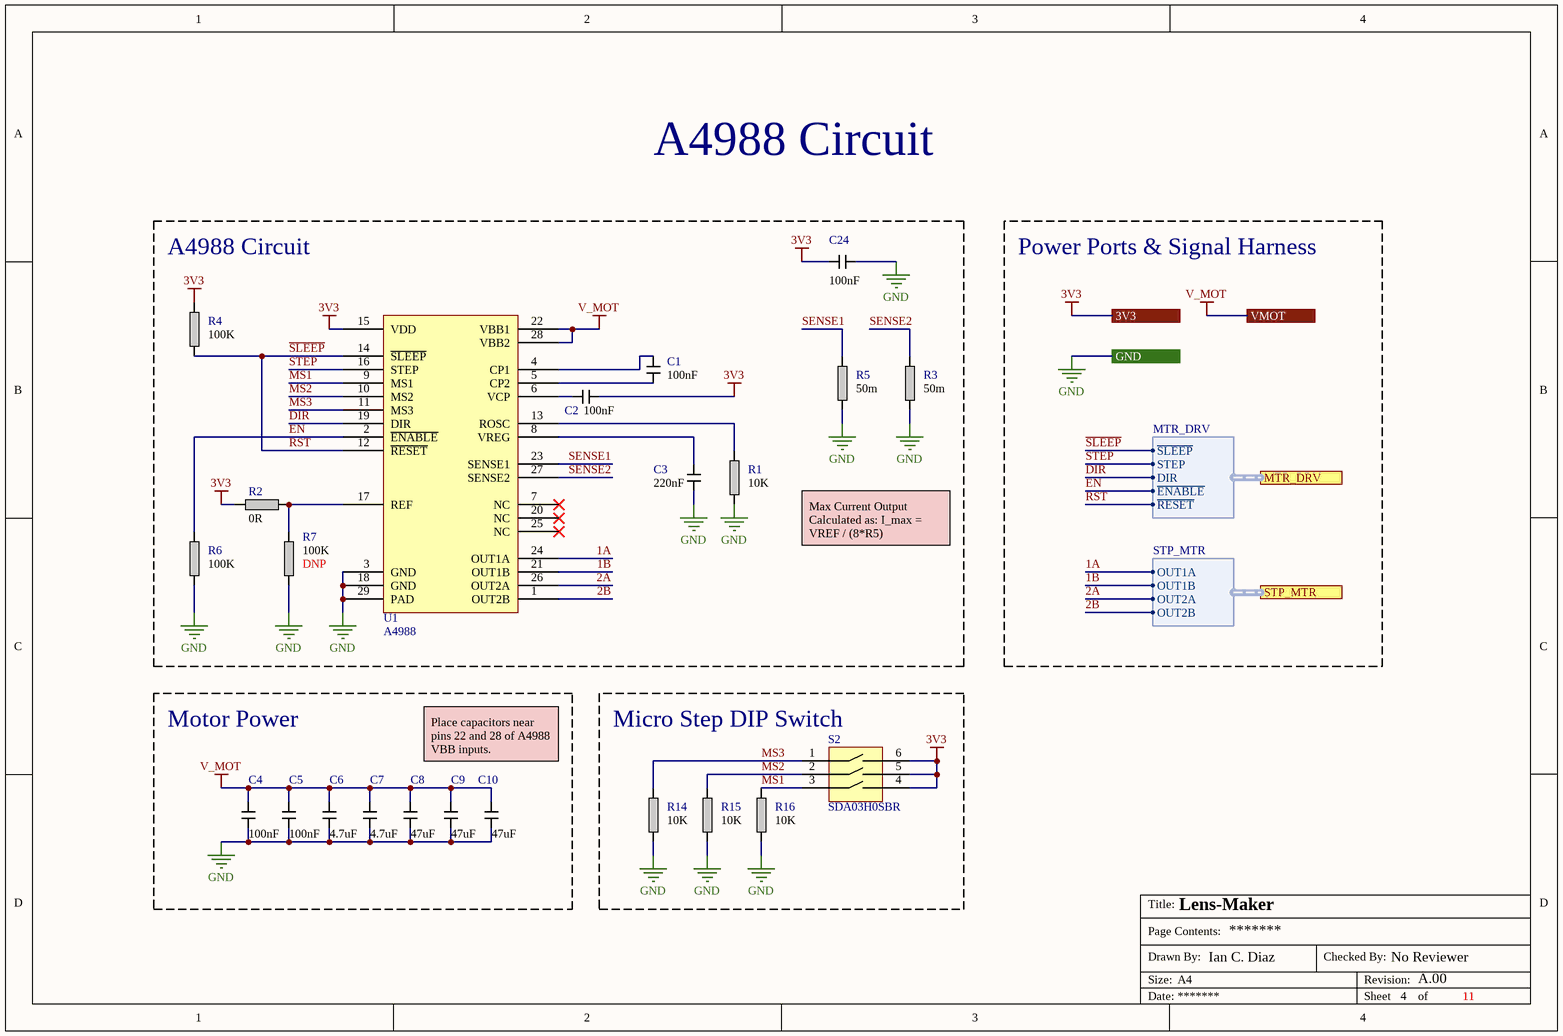
[diagram p7: A4988.SchDoc]

### Parts
C1  value 100nF  [0805]  (hidden comment: CAP)
C2  value 100nF  [0805]  (hidden comment: CAP)
C3  value 220nF  [0805]  (hidden comment: CAP)
C4  value 100nF  [0805]  (hidden comment: CAP)
C5  value 100nF  [0805]  (hidden comment: CAP)
C6  value 4.7uF  [0805]  (hidden comment: CAP)
C7  value 4.7uF  [0805]  (hidden comment: CAP)
C8  value 47uF  [1206]  (hidden comment: CAP)
C9  value 47uF  [1206]  (hidden comment: CAP)
C10  value 47uF  [1206]  (hidden comment: CAP)
C24  value 100nF  [0805]  (hidden comment: CAP)
R1  value 10K  [0805]  (hidden comment: RES)
R2  value 0R  [0805]  (hidden comment: RES)
R3  value 50m  [0805]  (hidden comment: RES)
R4  value 100K  [0805]  (hidden comment: RES)
R5  value 50m  [0805]  (hidden comment: RES)
R6  value 100K  [0805]  (hidden comment: RES)
R7  value 100K  Comments: DNP  [0805]  (hidden comment: RES)
R14  value 10K  [0805]  (hidden comment: RES)
R15  value 10K  [0805]  (hidden comment: RES)
R16  value 10K  [0805]  (hidden comment: RES)
S2  DIP SWITCH 3POS  [SDA03H0SBR]  (value not drawn)
U1  A4988  [28-QFN]

### Blocks framed on the sheet
A4988 Circuit: C1-C3 C24 R1-R7 U1
Motor Power: C4-C10
Micro Step DIP Switch: R14-R16 S2

### Ports
3V3 (see Stepper_Driver[2C], ESP32_Block[3C], ESP32_Module[3B], GPIO_Header[3B], I2C_Header[3B], Power[3B], SPI_Header[3B], Stepper_Driver[3A]), GND (see Stepper_Driver[2C], ESP32_Block[3D], ESP32_Module[3B], GPIO_Header[3B], I2C_Header[3B], Mechanical_Holes[3B], Power[3C], SPI_Header[3B], Stepper_Driver[3B], USB_Connector[3B]), MTR_DRV (harness MTR_DRV, see Stepper_Driver[2C]), STP_MTR (harness STP_MTR, see Stepper_Driver[2C]), VMOT (see Stepper_Driver[2C])

### Harnesses
MTR_DRV: ~{SLEEP}, STEP, DIR, ~{ENABLE}, ~{RESET}
STP_MTR: OUT1A, OUT1B, OUT2A, OUT2B

### Nets
3V3: C2.1 C24.1 R2.2 R4.1 S2.4 S2.5 S2.6 U1.15(VDD) ; port 3V3
GND: C3.1 C4.1 C5.1 C6.2 C7.2 C8.2 C9.2 C10.2 C24.2 R1.1 R3.1 R5.1 R6.2 R7.2 R14.1 R15.1 R16.1 U1.3(GND) U1.18(GND) U1.29(PAD) ; port GND
V_MOT: C4.2 C5.2 C6.1 C7.1 C8.1 C9.1 C10.1 U1.22(VBB1) U1.28(VBB2) ; port VMOT
1A: U1.24(OUT1A) ; port STP_MTR.OUT1A
1B: U1.21(OUT1B) ; port STP_MTR.OUT1B
2A: U1.26(OUT2A) ; port STP_MTR.OUT2A
2B: U1.1(OUT2B) ; port STP_MTR.OUT2B
DIR: U1.19(DIR) ; port MTR_DRV.DIR
~{EN}: R6.1 U1.2(~{ENABLE}) ; port MTR_DRV.~{ENABLE}
MS1: R16.2 S2.3 U1.9(MS1)
MS2: R15.2 S2.2 U1.10(MS2)
MS3: R14.2 S2.1 U1.11(MS3)
~{RST}: R4.2 U1.12(~{RESET}) U1.14(~{SLEEP}) ; port MTR_DRV.~{SLEEP}, port MTR_DRV.~{RESET}  [also labelled ~{SLEEP}]
SENSE1: R5.2 U1.23(SENSE1)
SENSE2: R3.2 U1.27(SENSE2)
STEP: U1.16(STEP) ; port MTR_DRV.STEP
NetC1_1: C1.1 U1.5(CP2)
NetC1_2: C1.2 U1.4(CP1)
NetC2_2: C2.2 U1.6(VCP)
NetC3_2: C3.2 U1.8(VREG)
NetR1_2: R1.2 U1.13(ROSC)
NetR2_1: R2.1 R7.1 U1.17(REF)

Not connected (* = marked no-connect by the designer): U1 7(NC)* 20(NC)* 25(NC)*

### Channels
U_Stepper_Driver/U_A4988: designators C1=C1_3 C2=C2_3 C3=C3_3 C4=C4_3 C5=C5_3 C6=C6_3 C7=C7_3 C8=C8_3 C9=C9_3 C10=C10_3 C24=C24_1 R1=R1_3 R2=R2_1 R3=R3_3 R4=R4_3 R5=R5_3 R6=R6_3 R7=R7_3 R14=R14_3 R15=R15_3 R16=R16_3 S2=S2_3 U1=U1_3; ports 3V3=3V3 GND=GND VMOT=V_MOT
U_Stepper_Driver/U_A4988: designators end in _2; ports 3V3=3V3 GND=GND VMOT=V_MOT
U_Stepper_Driver/U_A4988: designators C1=C1_1 C2=C2_1 C3=C3_1 C4=C4_1 C5=C5_1 C6=C6_1 C7=C7_1 C8=C8_1 C9=C9_1 C10=C10_1 C24=C24_3 R1=R1_1 R2=R2_3 R3=R3_1 R4=R4_1 R5=R5_1 R6=R6_1 R7=R7_1 R14=R14_1 R15=R15_1 R16=R16_1 S2=S2_1 U1=U1_1; ports 3V3=3V3 GND=GND VMOT=V_MOT

### Notes on the sheet
- A4988 Circuit
- Power Ports & Signal Harness
- Max Current Output Calculated as: I_max = VREF / (8*R5)
- Place capacitors near pins 22 and 28 of A4988 VBB inputs.
- Title:
- Size:
- Date:
- Drawn By:
- Page Contents:
- A4
- Checked By:
- Revision:
- Sheet
- of

### Library data of the parts
C1 C2 C4 C5 C24 = CAP: as C16 on sheet ESP32_Block; Supplier: JLCPCB; Supplier Part Number: C49678
C3 = CAP: 50V 220nF X7R ±10% 0805  Multilayer Ceramic Capacitors MLCC - SMD/SMT ROHS; Manufacturer: Samsung Electro-Mechanics; Manufacturer Part Number: CL21B224KBFNNNE; Supplier: JLCPCB; Supplier Part Number: C5378
C6 C7 = CAP: as C15 on sheet ESP32_Block; Supplier: JLCPCB; Supplier Part Number: C560882
C8-C10 = CAP: as C11 on sheet ESP32_Block; Supplier: JLCPCB; Supplier Part Number: C76659
R1 R14-R16 = RES: as R9 on sheet ESP32_Block; Supplier: JLCPCB; Supplier Part Number: C17414
R2 = RES: as R23 on sheet ESP32_Block; Supplier: JLCPCB; Supplier Part Number: C169855
R3 R5 = RES: 250mW ±1% 50mΩ 0805  Chip Resistor - Surface Mount ROHS; Manufacturer: YAGEO; Manufacturer Part Number: PE0805FRF7W0R05L; Supplier: JLCPCB; Supplier Part Number: C858613
R4 R6 R7 = RES: 125mW ±5% 100kΩ 0805  Chip Resistor - Surface Mount ROHS; Manufacturer: FH (Guangdong Fenghua Advanced Tech); Manufacturer Part Number: RS-05K104JT; Supplier: JLCPCB; Supplier Part Number: C118844
S2 = DIP SWITCH 3POS: SWITCH SLIDE DIP SPST 25MA 24V; Manufacturer: C&K; Supplier: JLCPCB; Supplier Part Number: C221950; Manufacturer Part Number: SDA03H0SBR
U1 = A4988: IC MTR DRVR BIPOLAR 3-5.5V 28QFN; Manufacturer: Allegro MicroSystems, LLC; Manufacturer Part Number: A4988SETTR-T; Supplier: JLCPCB; Supplier Part Number: C38437

## Sheet USB_Connector.SchDoc: Title
size A4; Date: *******; ApprovedBy: *******; CheckedBy: None; Author: *******; CompanyName: *******; DrawnBy: Name; Engineer: *******; Organization: *******; Address1: *******; Address2: *******; Address3: *******; Address4: *******; DocumentNumber: 10; Revision: *******; SheetNumber: 10; SheetTotal: 11; CurrentTime: *******; CurrentDate: *******; Time: *******; DocumentFullPathAndName: *******; DocumentName: *******; ModifiedDate: *******; ImagePath: *******; ProjectName: *******; Application_BuildNumber: *******
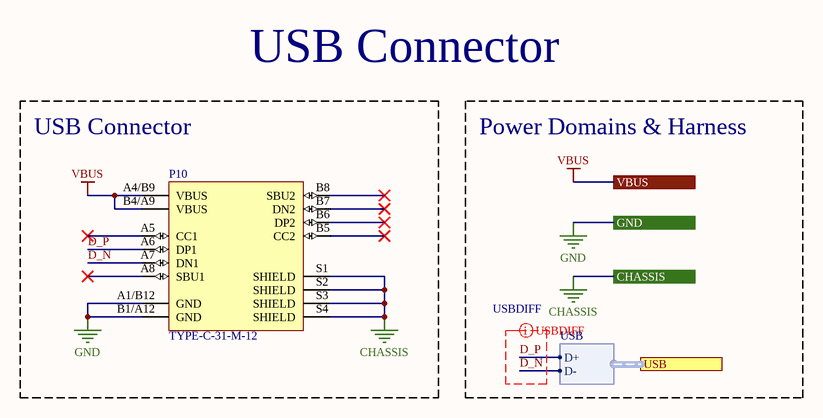
[diagram p8: USB_Connector.SchDoc]

### Parts
P10  TYPE-C-31-M-12  [TYPE-C-31-M-12]

### Blocks framed on the sheet
USB Connector: P10

### Ports
CHASSIS (see Lens-Maker[2B], ESP32_Block[3D], Mechanical_Holes[3C]), GND (see Lens-Maker[1B], A4988[3B], ESP32_Block[3D], ESP32_Module[3B], GPIO_Header[3B], I2C_Header[3B], Mechanical_Holes[3B], Power[3C], SPI_Header[3B], Stepper_Driver[3B]), USB (harness USB, see Lens-Maker[2B], ESP32_Block[3C], ESP32_Module[2B]), VBUS (see Lens-Maker[1B], ESP32_Block[3C], ESP32_Module[4B], Power[3B])

### Harnesses
USB: D+, D-

### Nets
CHASSIS: P10.S1(SHIELD) P10.S2(SHIELD) P10.S3(SHIELD) P10.S4(SHIELD) ; port CHASSIS
GND: P10.A1/B12(GND) P10.B1/A12(GND) ; port GND
VBUS: P10.A4/B9(VBUS) P10.B4/A9(VBUS) ; port VBUS
D_N: P10.A7(DN1) ; port USB.D-
D_P: P10.A6(DP1) ; port USB.D+

Not connected (* = marked no-connect by the designer): P10 A5(CC1)* A8(SBU1)* B5(CC2)* B6(DP2)* B7(DN2)* B8(SBU2)*

### Layout directives
differential pair; differential pair class USBDIFF: D_N, D_P

### Notes on the sheet
- USB Connector
- Power Domains & Harness
- Title:
- Size:
- Date:
- Drawn By:
- Page Contents:
- A4
- Checked By:
- Revision:
- Sheet
- of

### Library data of the parts
P10 = TYPE-C-31-M-12: USB C SMD Connector; Manufacturer: Korean Hroparts Elec; Supplier: JLCPCB; Supplier Part Number: C165948; Manufacturer Part Number: TYPE-C-31-M-12

## Sheet Power.SchDoc: Title
size A4; Date: *******; ApprovedBy: *******; CheckedBy: None; Author: *******; CompanyName: *******; DrawnBy: Name; Engineer: *******; Organization: *******; Address1: *******; Address2: *******; Address3: *******; Address4: *******; DocumentNumber: 2; Revision: *******; SheetNumber: 2; SheetTotal: 11; CurrentTime: *******; CurrentDate: *******; Time: *******; DocumentFullPathAndName: *******; DocumentName: *******; ModifiedDate: *******; ImagePath: *******; ProjectName: *******; Application_BuildNumber: *******
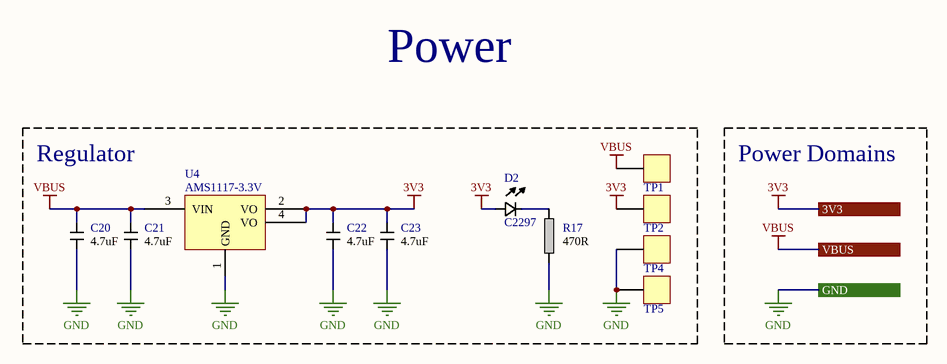
[diagram p9: Power.SchDoc]

### Parts
C20  value 4.7uF  [0805]  (hidden comment: CAP)
C21  value 4.7uF  [0805]  (hidden comment: CAP)
C22  value 4.7uF  [0805]  (hidden comment: CAP)
C23  value 4.7uF  [0805]  (hidden comment: CAP)
D2  Manufacturer Part Number: C2297  [0805]  (hidden comment: LED)
R17  value 470R  [0805]  (hidden comment: RES)
TP1  5V  [5015]  (value not drawn)
TP2  3V3  [5015]  (value not drawn)
TP4  GND  [5015]  (value not drawn)
TP5  GND  [5015]  (value not drawn)
U4  AMS1117-3.3V  [SOT-223]

### Blocks framed on the sheet
Regulator: C20-C23 D2 R17 TP1 TP2 TP4 TP5 U4

### Ports
3V3 (see Lens-Maker[2A], A4988[3B], ESP32_Block[3C], ESP32_Module[3B], GPIO_Header[3B], I2C_Header[3B], SPI_Header[3B], Stepper_Driver[3A]), GND (see Lens-Maker[1B], A4988[3B], ESP32_Block[3D], ESP32_Module[3B], GPIO_Header[3B], I2C_Header[3B], Mechanical_Holes[3B], SPI_Header[3B], Stepper_Driver[3B], USB_Connector[3B]), VBUS (see Lens-Maker[1A], ESP32_Block[3C], ESP32_Module[4B], USB_Connector[3B])

### Nets
3V3: C22.1 C23.1 D2.1 TP2.1 U4.2(VO) U4.4(VO) ; port 3V3
GND: C20.2 C21.2 C22.2 C23.2 R17.2 TP4.1 TP5.1 U4.1(GND) ; port GND
VBUS: C20.1 C21.1 TP1.1 U4.3(VIN) ; port VBUS
NetD2_2: D2.2 R17.1

### Notes on the sheet
- Power
- Power Domains
- Title:
- Size:
- Date:
- Drawn By:
- Page Contents:
- A4
- Checked By:
- Revision:
- Sheet
- of

### Library data of the parts
C20-C23 = CAP: as C15 on sheet ESP32_Block; Supplier: JLCPCB; Supplier Part Number: C560882
D2 = LED: as D1 on sheet Stepper_Driver; Supplier: JLCPCB; Supplier Part Number: C2297
R17 = RES: as R10 on sheet ESP32_Block; Supplier: JLCPCB; Supplier Part Number: C17710
TP1 TP2 TP4 TP5 = TESTPOINT_5015: as TP3 on sheet Stepper_Driver; Supplier: JLCPCB; Supplier Part Number: C5199798
U4 = AMS1117-3.3V: IC-1117 V.reg. 1A 3V3 SOT223 SMD Ams; Manufacturer: Shenzhen Fuman Elec; Supplier: JLCPCB; Supplier Part Number: C173386; Manufacturer Part Number: AMS1117-3.3V

## Sheet Mechanical_Holes.SchDoc: Title
size A4; Date: *******; ApprovedBy: *******; CheckedBy: None; Author: *******; CompanyName: *******; DrawnBy: Name; Engineer: *******; Organization: *******; Address1: *******; Address2: *******; Address3: *******; Address4: *******; DocumentNumber: 11; Revision: *******; SheetNumber: 11; SheetTotal: 11; CurrentTime: *******; CurrentDate: *******; Time: *******; DocumentFullPathAndName: *******; DocumentName: *******; ModifiedDate: *******; ImagePath: *******; ProjectName: *******; Application_BuildNumber: *******
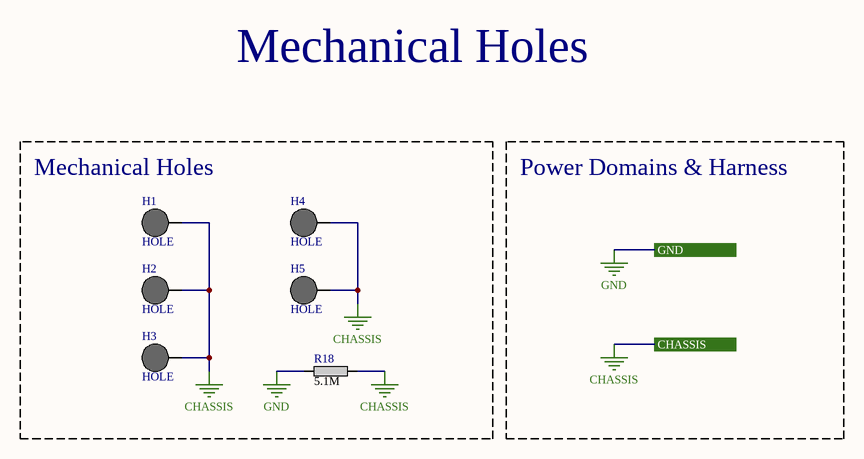
[diagram p10: Mechanical_Holes.SchDoc]

### Parts
H1  HOLE  [HOLE_M3]
H2  HOLE  [HOLE_M3]
H3  HOLE  [HOLE_M3]
H4  HOLE  [HOLE_M3]
H5  HOLE  [HOLE_M3]
R18  value 5.1M  [0805]  (hidden comment: RES)

### Blocks framed on the sheet
Mechanical Holes: H1-H5 R18

### Ports
CHASSIS (see Lens-Maker[3D], ESP32_Block[3D], USB_Connector[3C]), GND (see Lens-Maker[3D], A4988[3B], ESP32_Block[3D], ESP32_Module[3B], GPIO_Header[3B], I2C_Header[3B], Power[3C], SPI_Header[3B], Stepper_Driver[3B], USB_Connector[3B])

### Nets
CHASSIS: H1.1 H2.1 H3.1 H4.1 H5.1 R18.1 ; port CHASSIS
GND: R18.2 ; port GND

### Notes on the sheet
- Mechanical Holes
- Power Domains & Harness
- Title:
- Size:
- Date:
- Drawn By:
- Page Contents:
- A4
- Checked By:
- Revision:
- Sheet
- of

### Library data of the parts
H1-H5 = HOLE: Hole M3
R18 = RES: 125mW Thick Film Resistors ±1% 5.1MΩ 0805  Chip Resistor - Surface Mount ROHS; Manufacturer: TA-I Tech; Manufacturer Part Number: RM10FTN5104; Supplier: JLCPCB; Supplier Part Number: C156163

## Nets that join several sheets
3V3: ESP32_Block (8 pins), U_GPIO_Header (P9_2.1), I2C_Header (P8.1 P8.3 R19.1 R20.1), SPI_Header (P7.1), U_Stepper_Driver/U_A4988 (8 pins), U_Stepper_Driver/U_A4988 (8 pins), U_Stepper_Driver/U_A4988 (8 pins), U_GPIO_Header (P9_1.1), Power (6 pins)
CHASSIS: USB_Connector (P10.S1 P10.S2 P10.S3 P10.S4), Mechanical_Holes (6 pins)
GND: ESP32_Block (18 pins), U_GPIO_Header (P9_2.2), I2C_Header (P8.2 P8.4), SPI_Header (P7.2), Stepper_Driver (P1.2 P1.3 P5.2 R8.1), U_Stepper_Driver/U_A4988 (20 pins), U_Stepper_Driver/U_A4988 (20 pins), U_Stepper_Driver/U_A4988 (20 pins), U_GPIO_Header (P9_1.2), USB_Connector (P10.A1/B12 P10.B1/A12), Power (8 pins), Mechanical_Holes (R18.2)
V_MOT: Stepper_Driver (D1.1 P1.4 P5.1 TP3.1), U_Stepper_Driver/U_A4988 (9 pins), U_Stepper_Driver/U_A4988 (9 pins), U_Stepper_Driver/U_A4988 (9 pins)
VBUS: ESP32_Block (5 pins), USB_Connector (P10.A4/B9 P10.B4/A9), Power (C20.1 C21.1 TP1.1 U4.3)
1A: Stepper_Driver (P2.2), U_Stepper_Driver/U_A4988 (U1_3.24)
1A: Stepper_Driver (P3.2), U_Stepper_Driver/U_A4988 (U1_2.24)
1A: Stepper_Driver (P4.2), U_Stepper_Driver/U_A4988 (U1_1.24)
1B: Stepper_Driver (P2.1), U_Stepper_Driver/U_A4988 (U1_3.21)
1B: Stepper_Driver (P3.1), U_Stepper_Driver/U_A4988 (U1_2.21)
1B: Stepper_Driver (P4.1), U_Stepper_Driver/U_A4988 (U1_1.21)
2A: Stepper_Driver (P2.3), U_Stepper_Driver/U_A4988 (U1_3.26)
2A: Stepper_Driver (P3.3), U_Stepper_Driver/U_A4988 (U1_2.26)
2A: Stepper_Driver (P4.3), U_Stepper_Driver/U_A4988 (U1_1.26)
2B: Stepper_Driver (P2.4), U_Stepper_Driver/U_A4988 (U1_3.1)
2B: Stepper_Driver (P3.4), U_Stepper_Driver/U_A4988 (U1_2.1)
2B: Stepper_Driver (P4.4), U_Stepper_Driver/U_A4988 (U1_1.1)
CS: ESP32_Block (U2.29), SPI_Header (P7.6)
D_N: ESP32_Block (U3.5), USB_Connector (P10.A7)
D_P: ESP32_Block (U3.4), USB_Connector (P10.A6)
DIR: ESP32_Block (U2.9), U_Stepper_Driver/U_A4988 (U1_1.19)
DIR: ESP32_Block (U2.11), U_Stepper_Driver/U_A4988 (U1_2.19)
DIR: ESP32_Block (U2.26), U_Stepper_Driver/U_A4988 (U1_3.19)
IN1: ESP32_Block (U2.6), U_GPIO_Header (P9_2.3)
IN1: ESP32_Block (U2.4), U_GPIO_Header (P9_1.3)
IN2: ESP32_Block (U2.7), U_GPIO_Header (P9_1.4)
IN2: ESP32_Block (U2.27), U_GPIO_Header (P9_2.4)
IN3: ESP32_Block (U2.24), U_GPIO_Header (P9_1.5)
IN3: ESP32_Block (U2.28), U_GPIO_Header (P9_2.5)
IN4: ESP32_Block (U2.5), U_GPIO_Header (P9_2.6)
IO18: ESP32_Block (U2.30), SPI_Header (P7.3)
IO19: ESP32_Block (U2.31), SPI_Header (P7.4)
IO21: ESP32_Block (U2.33), I2C_Header (P8.5 R19.2)
IO22: ESP32_Block (U2.36), I2C_Header (P8.6 R20.2)
IO23: ESP32_Block (U2.37), SPI_Header (P7.5)
IO25: ESP32_Block (U2.10), U_Stepper_Driver/U_A4988 (U1_2.16)
IO27: ESP32_Block (U2.12), U_Stepper_Driver/U_A4988 (U1_3.16)
IO32: ESP32_Block (U2.8), U_Stepper_Driver/U_A4988 (U1_1.16)

## Assembly variants
[Development-Model]: not fitted R7_1 R7_2 R7_3 R23